# EAGLE design ble112 (EAGLE 7.5.0)
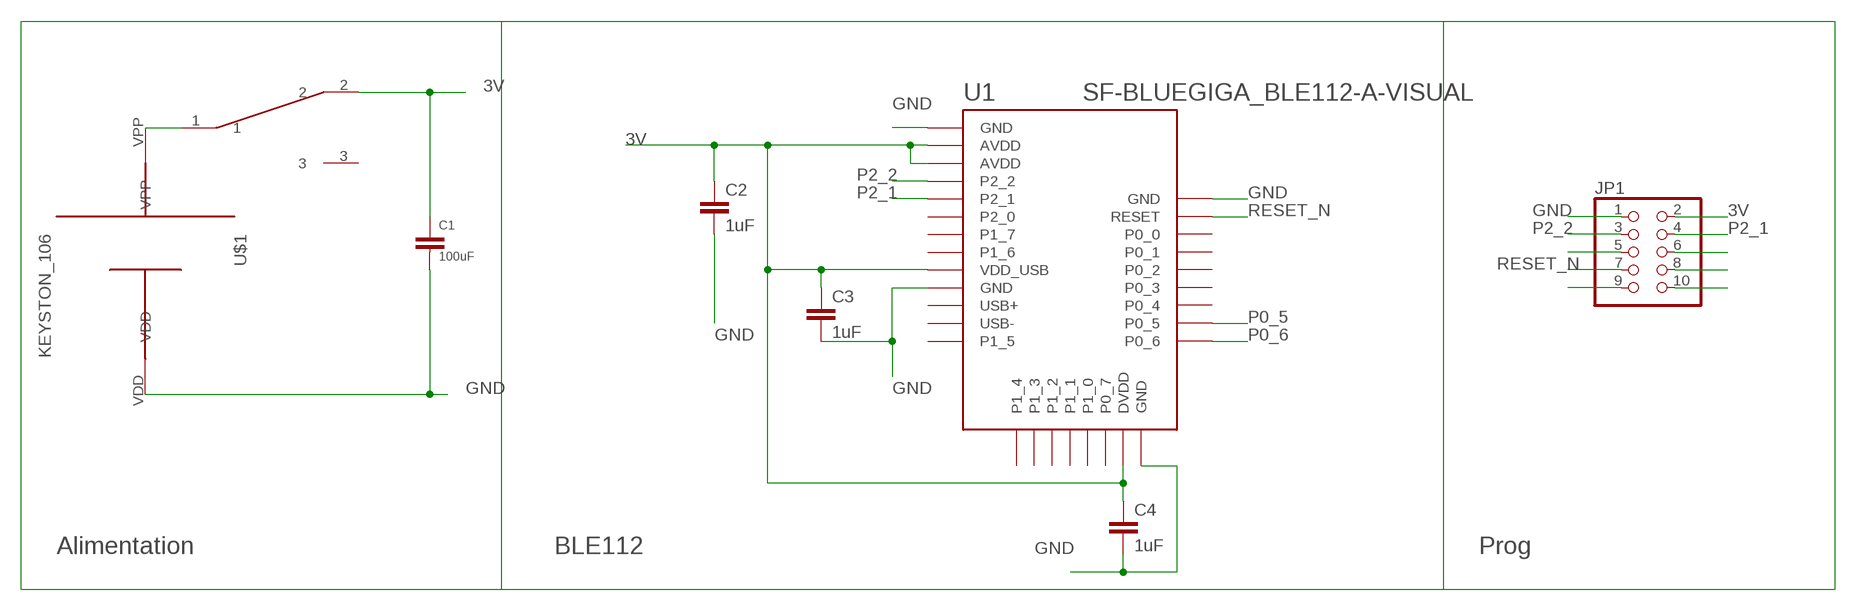
[diagram p0: schematic, sheet 1]

## Parts
C1  100uF  C_1206  [R1206]
C2  1uF  C-EUC1210  [C1210]
C3  1uF  C-EUC1210  [C1210]
C4  1uF  C-EUC1210  [C1210]
JP1  PINHD-2X5  [2X05]
U1  SF-BLUEGIGA_BLE112-A-VISUAL  [SF-BLUEGIGA_BLE112-A]
U$1  KEYSTON_106  [CELL_HOLDER_PACKAGE]
U$2  1K2  [1X03/90]

## Nets
3V: C1.1 C2.1 C3.1 C4.1 JP1.2 U1.AVDD1(AVDD) U1.AVDD2(AVDD) U1.DVDD U1.VDD_USB U$2.2
CELL_VOLTAGE: U$1.VPP U$2.1
GND: C1.2 C2.2 C3.2 C4.2 JP1.1 U1.GND1(GND) U1.GND2(GND) U1.GND3(GND) U1.GND4(GND) U$1.VDD
N$4: JP1.5
N$6: JP1.9
N$9: JP1.6
N$10: JP1.8
N$11: JP1.10
P0_5: U1.P0_5
P0_6: U1.P0_6
P2_1: JP1.4 U1.P2_1
P2_2: JP1.3 U1.P2_2
RESET_N: JP1.7 U1.RESET
Unconnected: U1.P0_0 U1.P0_1 U1.P0_2 U1.P0_3 U1.P0_4 U1.P0_7 U1.P1_0 U1.P1_1 U1.P1_2 U1.P1_3 U1.P1_4 U1.P1_5 U1.P1_6 U1.P1_7 U1.P2_0 U1.USB+ U1.USB- U$2.3

## Notes on the sheet
- Alimentation | BLE112 | Prog

## Library data of the parts
C1 = @Club_passif:C_
C2-C4 = rcl:C-EU: CAPACITOR, European symbol
JP1 = pinhead:PINHD-2X5: PIN HEADER
U1 = ble112:SF-BLUEGIGA_BLE112-A-VISUAL: Bluetooth Low Energy single-mode module - Bluetooth 4.0, chip antenna
U$1 = keystone_106:KEYSTON_106: Support de pile Keystone 106 pour CR2032
U$2 = 1K2:1K2

## Board
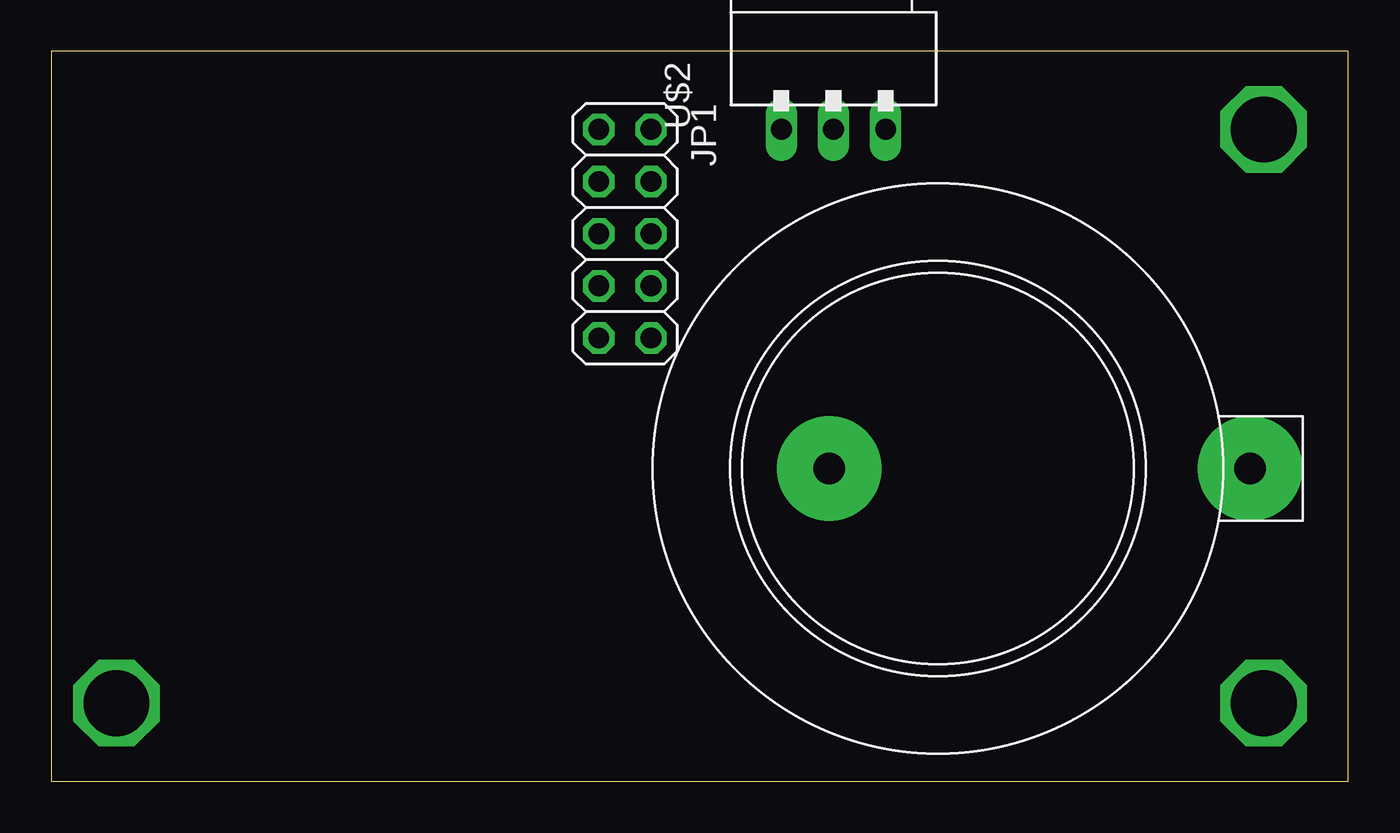
[diagram p1: board, top side]
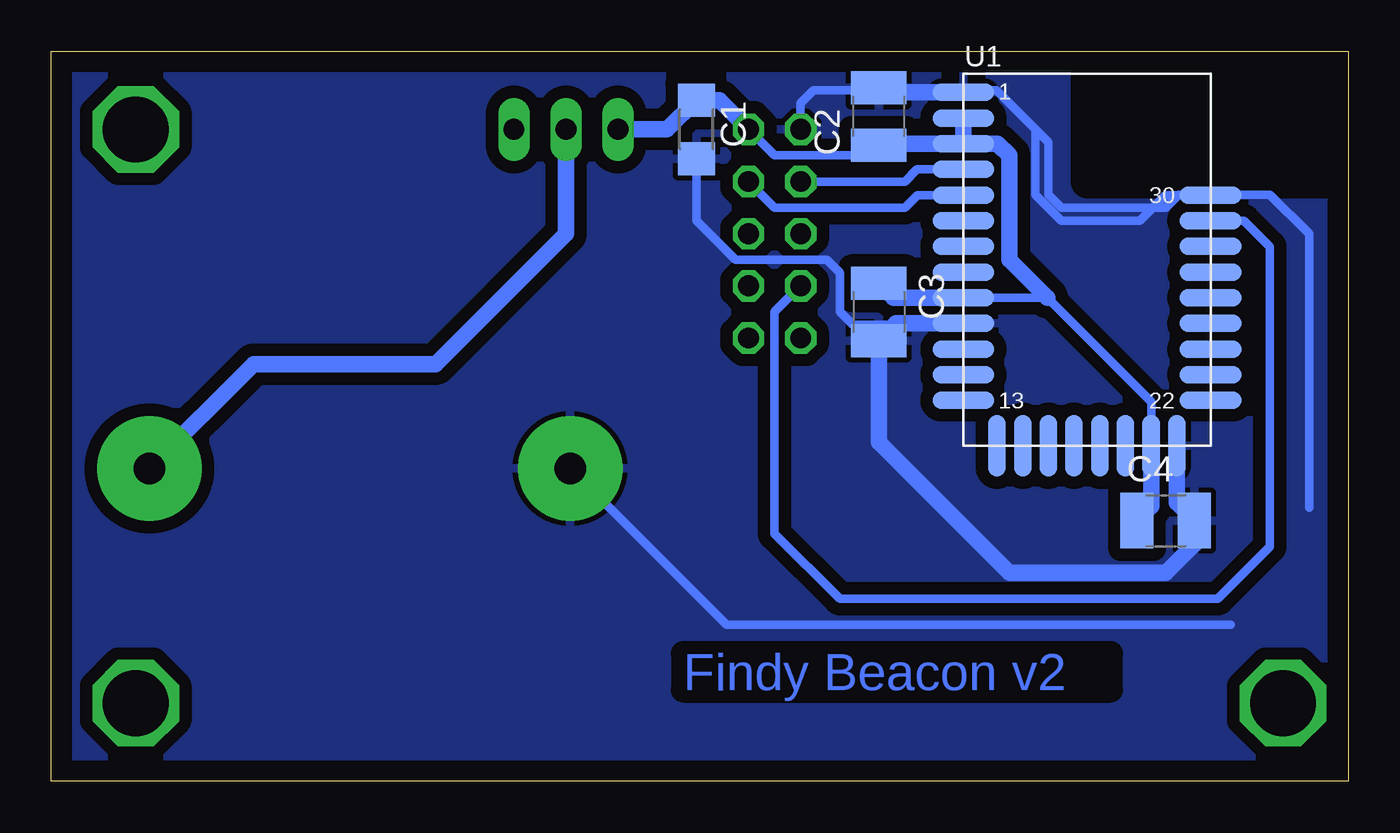
[diagram p2: board, bottom side, seen from below]

Size 63.17 x 35.55 mm. Coordinates in mm from the lower left corner, seen from the top.
Outline: 0,0 63.17,0 63.17,35.55 0,35.55 0,0
Copper layers (1*16): Top 0.035mm / dielectric 1.5mm / Bottom 0.035mm
Design rules "default": minimum track width 10mil, minimum drill 24mil, track to track 8mil, track to pad 8mil, pad to pad 8mil, via to via 8mil, smd to smd 8mil, copper to edge 40mil, drill to drill 8mil, minimum pad ring 10mil, minimum via ring 8mil, stop-mask expansion 4mil, vias tented up to drill 0mil, thermal gap 10mil
bRestrict: area 1.3,29.2 to 12.7,34.3

### Footprints (pad centres in the part's own frame; a part is rotated, then mirrored left to right if it is on the bottom)
R1206 = smd 1.6 x 1.803: 1 -1.422,0; 2 1.422,0
C1210 = smd 1.6 x 2.7: 1 -1.4,0; 2 1.4,0
2X05 = drill 1.016 octagon: 1 -5.08,-1.27; 2 -5.08,1.27; 3 -2.54,-1.27; 4 -2.54,1.27; 5 0,-1.27; 6 0,1.27; 7 2.54,-1.27; 8 2.54,1.27; 9 5.08,-1.27; 10 5.08,1.27
SF-BLUEGIGA_BLE112-A = smd 3 x 0.85: AVDD1 -6.05,6.9; AVDD2 -6.05,5.65; GND1 -6.05,8.15; GND2 -6.05,-3.1; GND4 6,3.15; P0_0 6,0.65; P0_1 6,-0.6; P0_2 6,-1.85; P0_3 6,-3.1; P0_4 6,-4.35; P0_5 6,-5.6; P0_6 6,-6.85; P1_5 -6.05,-6.85; P1_6 -6.05,-0.6; P1_7 -6.05,0.65; P2_0 -6.05,1.9; P2_1 -6.05,3.15; P2_2 -6.05,4.4; RESET 6,1.9; USB+ -6.05,-4.35; USB- -6.05,-5.6; VDD_USB -6.05,-1.85 | smd 0.85 x 3: DVDD 3.1,-9.05; GND3 4.35,-9.05; P0_7 1.85,-9.05; P1_0 0.6,-9.05; P1_1 -0.65,-9.05; P1_2 -1.9,-9.05; P1_3 -3.15,-9.05; P1_4 -4.4,-9.05
CELL_HOLDER_PACKAGE = drill 1.524 pad 5.08: VDD -5.283,0; VPP 15.215,0
1X03/90 = drill 1.016 long: 1 0,-3.81; 2 -2.54,-3.81; 3 2.54,-3.81

### Placement (x,y rotation side)
C1  31.75,31.75 270 bottom
C2  22.86,32.39 90 bottom
C3  22.86,22.86 270 bottom
C4  8.89,12.7 0 bottom
JP1  27.94,26.67 270 top
U1  12.7,25.4 0 bottom
U$1  43.18,15.24 0 top
U$2  38.1,35.56 0 top

### Tracks (layer width: path | path; a pad name or v marks a point on that pad's centre or on a via)
3V
  Bottom 0.406: U1.VDD_USB 14.66,23.55 9.6,18.49 U1.DVDD | C2.1 23.37,30.48 27.94,30.48 JP1.2
  Bottom 0.813: U1.DVDD 9.6,13.39 C4.1 | U1.VDD_USB 22.15,23.55 C3.1 | U1.AVDD2 17.08,31.05 16.51,30.48 16.51,25.4 14.66,23.55 | U1.AVDD2 U1.AVDD1 | C2.1 22.8,31.05 U1.AVDD2 | U$2.2 33.17,31.75 C1.1 30.63,33.17 JP1.2
CELL_VOLTAGE
  Bottom 0.813: U$2.1 38.1,26.67 44.45,20.32 53.32,20.32 U$1.VPP
GND
  Bottom 0.406: U1.GND4 8.91,28.55 10.16,27.31 13.97,27.31 15.24,28.58 15.24,31.75 | 15.24,31.75 17.15,33.66 18.65,33.66 | 18.65,33.66 U1.GND1 | U1.GND2 18.83,22.22 24.13,22.22 24.77,22.86 24.77,24.77 25.4,25.4 29.85,25.4 31.75,27.31 C1.2 | JP1.1 26.67,33.02 26.04,33.66 18.65,33.66 | 15.24,31.75 14.61,31.11 14.61,28.58 13.97,27.94 8.89,27.94 8.26,28.58 3.81,28.58 1.91,26.67 1.91,13.34 | 5.72,7.62 30.28,7.62 U$1.VDD
  Bottom 0.813: U1.GND1 21.99,33.55 C2.2 | U1.GND3 8.35,13.56 C4.2 7.49,11.56 8.89,10.16 16.51,10.16 22.86,16.51 C3.2 22.02,22.3 U1.GND2
  pour Bottom (isolate 0.61): -0.63,36.83 64.13,36.83 64.13,-0.63 -0.63,-0.63
N$2  (via drill 3.2)
  other vias: 3.18,3.81
N$3  (via drill 3.2)
  other vias: 59.05,3.81
N$5  (via drill 3.2)
  other vias: 59.05,31.75
P2_1
  Bottom 0.406: JP1.4 27.94,27.94 21.59,27.94 20.98,28.55 U1.P2_1
P2_2
  Bottom 0.406: JP1.3 21.59,29.21 21,29.8 U1.P2_2
RESET_N
  Bottom 0.406: U1.RESET 5.08,27.3 3.81,26.03 3.81,11.43 6.35,8.89 24.77,8.89 27.94,12.06 27.94,22.86 JP1.7

### Text on the board
Bottom: Findy Beacon v2